# EAGLE schematic DAQ1 (EAGLE 7.6.0)
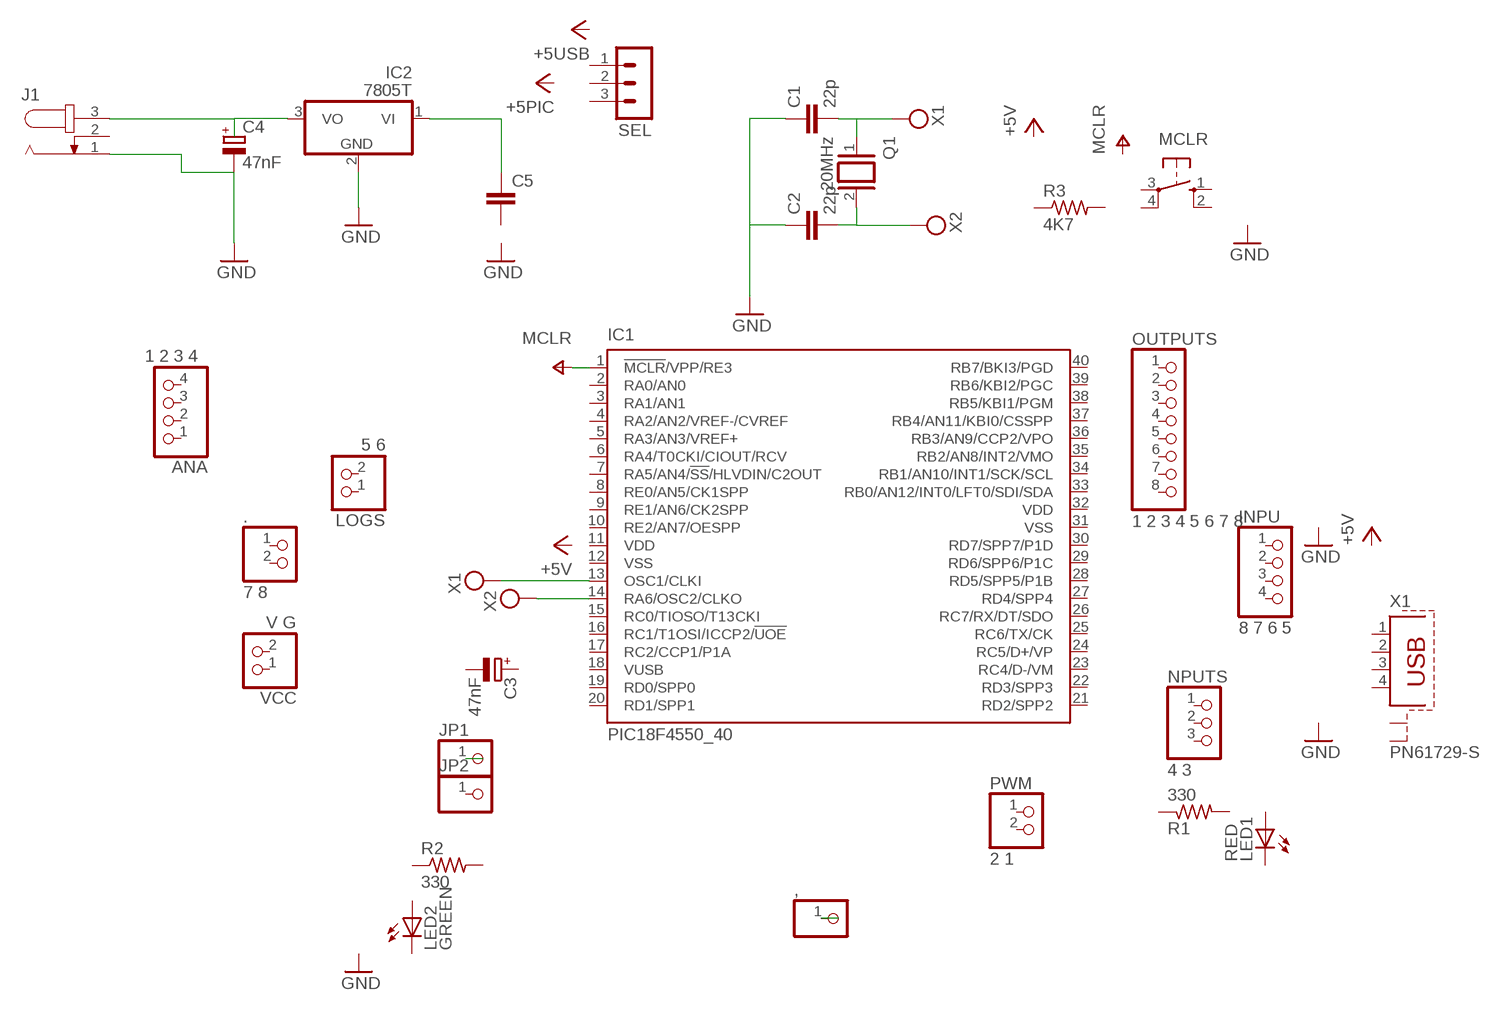
[diagram p0: schematic, sheet 1]

## Parts
,  PINHD-1X1  [1X01]
.  7 8  PINHD-1X2  [1X02]
ANA  1 2 3 4  PINHD-1X4  [1X04]
C1  22p  C-EU025-024X044  [C025-024X044]
C2  22p  C-EU025-024X044  [C025-024X044]
C3  47nF  CPOL-EUE2,5-6E  [E2,5-6E]
C4  47nF  CPOL-EUE2,5-6E  [E2,5-6E]
C5  C-EU050-035X075  [C050-035X075]
IC1  PIC18F4550_40  [DIL40]
IC2  7805T  [TO220H]
INPU  8 7 6 5  PINHD-1X4  [1X04]
J1  JACK-PLUG0  [SPC4077]
JP1  PINHD-1X1  [1X01]
JP2  PINHD-1X1  [1X01]
LED1  RED  TLLR4400  [LED3MM]
LED2  GREEN  TLLG4400  [LED3MM]
LOGS  5 6  PINHD-1X2  [1X02]
MCLR  10-XX  [B3F-10XX]
NPUTS  4 3  PINHD-1X3  [1X03]
OUTPUTS  1 2 3 4 5 6 7 8  PINHD-1X8  [1X08]
PWM  2 1  PINHD-1X2  [1X02]
Q1  20MHz  XTAL/S  [QS]
R1  330  R-US_0207/10  [0207/10]
R2  330  R-US_0207/10  [0207/10]
R3  4K7  R-US_0207/10  [0207/10]
SEL  MA03-1  [MA03-1]
VCC  V G  PINHD-1X2  [1X02]
X1  PN61729-S  [PN61729-S]

## Nets
GND: C1.1 C2.1 C4.- IC2.2(GND) J1.1
MCLR: IC1.1(!MCLR!/VPP/RE3)
N$1: C4.+ IC2.3(VO) J1.3
N$2: C5.1 IC2.1(VI)
N$4: ,.1
N$19: JP1.1
X1: C1.2 IC1.13(OSC1/CLKI) Q1.1
X2: C2.2 IC1.14(RA6/OSC2/CLKO) Q1.2
Unconnected: ..1 ..2 ANA.1 ANA.2 ANA.3 ANA.4 C3.+ C3.- C5.2 IC1.2(RA0/AN0) IC1.3(RA1/AN1) IC1.4(RA2/AN2/VREF-/CVREF) IC1.5(RA3/AN3/VREF+) IC1.6(RA4/T0CKI/CIOUT/RCV) IC1.7(RA5/AN4/!SS!/HLVDIN/C2OUT) IC1.8(RE0/AN5/CK1SPP) IC1.9(RE1/AN6/CK2SPP) IC1.10(RE2/AN7/OESPP) IC1.15(RC0/TIOSO/T13CKI) IC1.16(RC1/T1OSI/ICCP2/!UOE) IC1.17(RC2/CCP1/P1A) IC1.18(VUSB) IC1.19(RD0/SPP0) IC1.20(RD1/SPP1) IC1.21(RD2/SPP2) IC1.22(RD3/SPP3) IC1.23(RC4/D-/VM) IC1.24(RC5/D+/VP) IC1.25(RC6/TX/CK) IC1.26(RC7/RX/DT/SDO) IC1.27(RD4/SPP4) IC1.28(RD5/SPP5/P1B) IC1.29(RD6/SPP6/P1C) IC1.30(RD7/SPP7/P1D) IC1.33(RB0/AN12/INT0/LFT0/SDI/SDA) IC1.34(RB1/AN10/INT1/SCK/SCL) IC1.35(RB2/AN8/INT2/VMO) IC1.36(RB3/AN9/CCP2/VPO) IC1.37(RB4/AN11/KBI0/CSSPP) IC1.38(RB5/KBI1/PGM) IC1.39(RB6/KBI2/PGC) IC1.40(RB7/BKI3/PGD) INPU.1 INPU.2 INPU.3 INPU.4 J1.2 JP2.1 LED1.A LED1.K(C) LED2.A LED2.K(C) LOGS.1 LOGS.2 MCLR.1(S) MCLR.2(S1) MCLR.3(P) MCLR.4(P1) NPUTS.1 NPUTS.2 NPUTS.3 OUTPUTS.1 OUTPUTS.2 OUTPUTS.3 OUTPUTS.4 OUTPUTS.5 OUTPUTS.6 OUTPUTS.7 OUTPUTS.8 PWM.1 PWM.2 R1.1 R1.2 R2.1 R2.2 R3.1 R3.2 SEL.1 SEL.2 SEL.3 VCC.1 VCC.2 X1.1 X1.2 X1.3 X1.4 X1.S1 X1.S2

## Power pins joined to a net without a drawn wire
VDD: IC1.11(VDD) IC1.32(VDD)
VSS: IC1.12(VSS) IC1.31(VSS)

## Library data of the parts
, JP1 JP2 = pinhead:PINHD-1X1: PIN HEADER
. LOGS PWM VCC = pinhead:PINHD-1X2: PIN HEADER
ANA INPU = pinhead:PINHD-1X4: PIN HEADER
C1 C2 C5 = rcl:C-EU: CAPACITOR, European symbol
C3 C4 = resistor:CPOL-EU: POLARIZED CAPACITOR, European symbol
IC1 = microchip:PIC18F4*_40: USB Microcontrollers with nanoWatt Technology High-Performance, Enhanced Flash, 28/40/44-Pin, Source: http://ww1.microchip.com/downloads/en/devicedoc/39632c.pdf; MF: MICROCHIP; MPN: PIC18F4550-I/P; OC_FARNELL: 9321357; OC_NEWARK: 74K8623
IC2 = linear:78*: Positive VOLTAGE REGULATOR Source: http://cache.national.com/ds/LM/LM78L05.pdf http://www.fairchildsemi.com/ds/LM/LM7805.pdf
J1 = con-jack:JACK-PLUG: DC POWER JACK Power Jack, DC, Right Angle, Through Hole, Rated 5A at 16VDC, PC Terminals Distributor: Farnell (www.Farnell.de) Drawing: 84N1161.pdf / 84N1162.pdf Manufacturer: SPC Technology (www.spctechnology.com) Type: SPC4077 / SPC 4078; OC_FARNELL: unknown; OC_NEWARK: unknown
LED1 = led:TLLR4400: Low Current (2mA) LED 3 mm Tinted Diffused Package color RED Source: Data sheet <http://www.farnell.com/datasheets/391100.pdf>; MF: VISHAY SEMICONDUCTOR; OC_FARNELL: 1612437
LED2 = led:TLLG4400: Low Current (2mA) LED 3 mm Tinted Diffused Package color GREEN Source: Data sheet <http://www.farnell.com/datasheets/391098.pdf>; MF: VISHAY SEMICONDUCTOR; OC_FARNELL: 1612435
MCLR = switch-omron:10-XX: OMRON SWITCH; MPN: B3F-1000; OC_FARNELL: 176432; OC_NEWARK: 36M3542
NPUTS = pinhead:PINHD-1X3: PIN HEADER
OUTPUTS = pinhead:PINHD-1X8: PIN HEADER
Q1 = special:XTAL/S: CRYSTAL
R1-R3 = resistor:R-US_: RESISTOR, American symbol
SEL = con-lstb:MA03-1: PIN HEADER; OC_FARNELL: unknown; OC_NEWARK: unknown
X1 = con-berg:PN61729-S: BERG USB connector; OC_FARNELL: unknown; OC_NEWARK: unknown